# EasyEDA schematic SCH_Addressable through hole LEDs_2022-01-01.json
TITLE: Sheet_1; REV: 1.0; Date: 2021-12-31; Sheet: 1/1; Drawn By: limchengwei; Company: Your Company
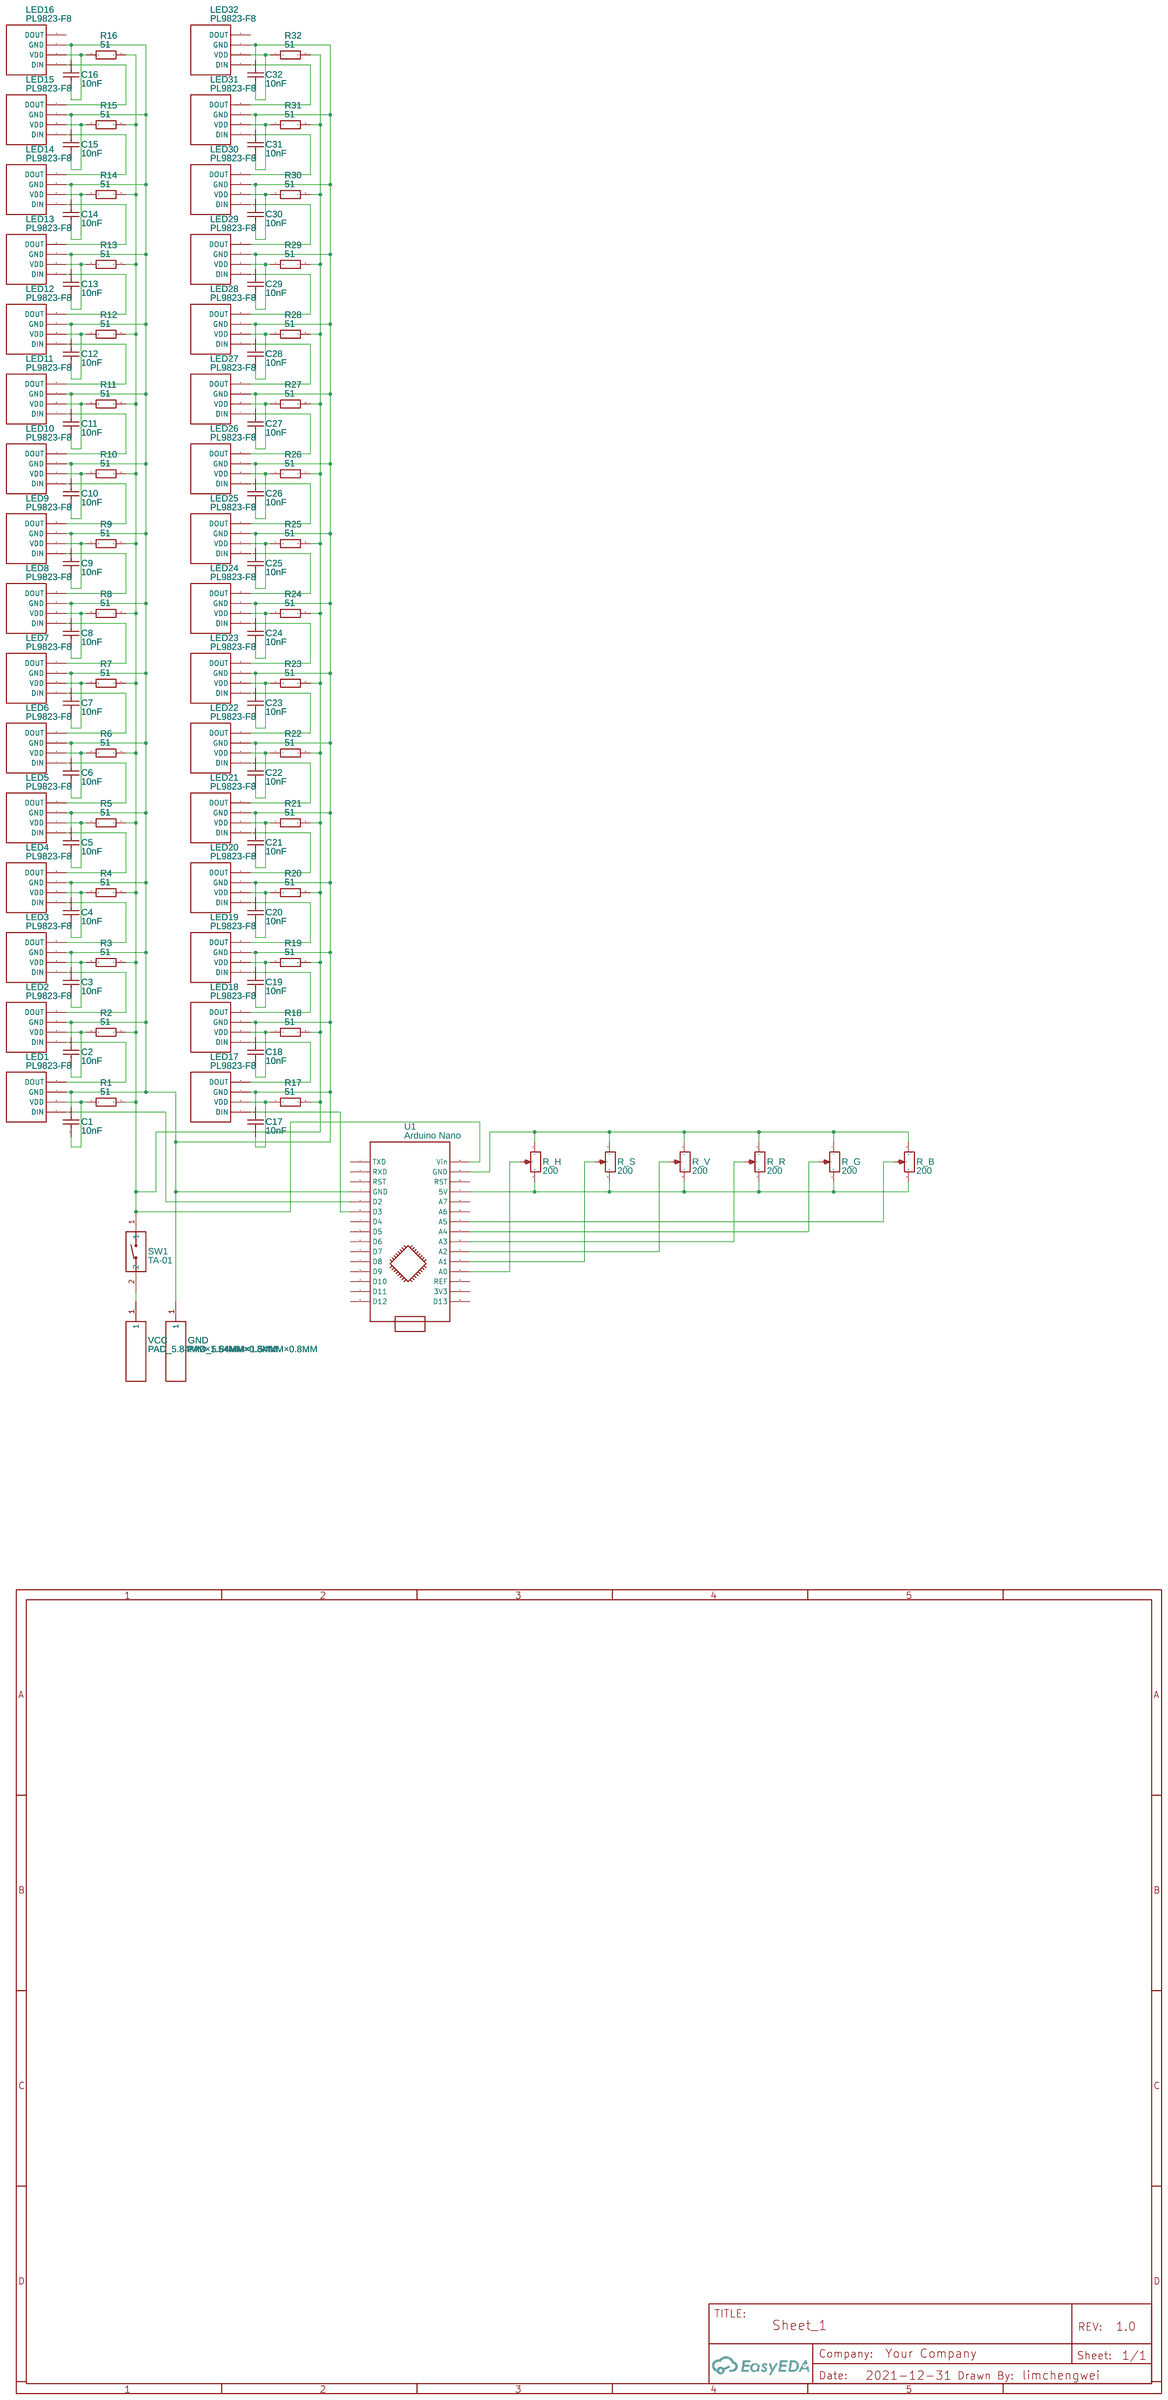
[diagram p0: schematic sheet]

## Parts
C1  10nF  [CAP-TH_L5.0-W2.5-P5.08-D0.7]
C2  10nF  [CAP-TH_L5.0-W2.5-P5.08-D0.7]
C3  10nF  [CAP-TH_L5.0-W2.5-P5.08-D0.7]
C4  10nF  [CAP-TH_L5.0-W2.5-P5.08-D0.7]
C5  10nF  [CAP-TH_L5.0-W2.5-P5.08-D0.7]
C6  10nF  [CAP-TH_L5.0-W2.5-P5.08-D0.7]
C7  10nF  [CAP-TH_L5.0-W2.5-P5.08-D0.7]
C8  10nF  [CAP-TH_L5.0-W2.5-P5.08-D0.7]
C9  10nF  [CAP-TH_L5.0-W2.5-P5.08-D0.7]
C10  10nF  [CAP-TH_L5.0-W2.5-P5.08-D0.7]
C11  10nF  [CAP-TH_L5.0-W2.5-P5.08-D0.7]
C12  10nF  [CAP-TH_L5.0-W2.5-P5.08-D0.7]
C13  10nF  [CAP-TH_L5.0-W2.5-P5.08-D0.7]
C14  10nF  [CAP-TH_L5.0-W2.5-P5.08-D0.7]
C15  10nF  [CAP-TH_L5.0-W2.5-P5.08-D0.7]
C16  10nF  [CAP-TH_L5.0-W2.5-P5.08-D0.7]
C17  10nF  [CAP-TH_L5.0-W2.5-P5.08-D0.7]
C18  10nF  [CAP-TH_L5.0-W2.5-P5.08-D0.7]
C19  10nF  [CAP-TH_L5.0-W2.5-P5.08-D0.7]
C20  10nF  [CAP-TH_L5.0-W2.5-P5.08-D0.7]
C21  10nF  [CAP-TH_L5.0-W2.5-P5.08-D0.7]
C22  10nF  [CAP-TH_L5.0-W2.5-P5.08-D0.7]
C23  10nF  [CAP-TH_L5.0-W2.5-P5.08-D0.7]
C24  10nF  [CAP-TH_L5.0-W2.5-P5.08-D0.7]
C25  10nF  [CAP-TH_L5.0-W2.5-P5.08-D0.7]
C26  10nF  [CAP-TH_L5.0-W2.5-P5.08-D0.7]
C27  10nF  [CAP-TH_L5.0-W2.5-P5.08-D0.7]
C28  10nF  [CAP-TH_L5.0-W2.5-P5.08-D0.7]
C29  10nF  [CAP-TH_L5.0-W2.5-P5.08-D0.7]
C30  10nF  [CAP-TH_L5.0-W2.5-P5.08-D0.7]
C31  10nF  [CAP-TH_L5.0-W2.5-P5.08-D0.7]
C32  10nF  [CAP-TH_L5.0-W2.5-P5.08-D0.7]
GND  PAD_5.84MM×1.54MM×0.8MM  [TESTPOINT-SMD_PAD_5.84MM-1.54MM-0.8MM]
LED1  PL9823-F8  [PL9823-F5]
LED2  PL9823-F8  [PL9823-F5]
LED3  PL9823-F8  [PL9823-F5]
LED4  PL9823-F8  [PL9823-F5]
LED5  PL9823-F8  [PL9823-F5]
LED6  PL9823-F8  [PL9823-F5]
LED7  PL9823-F8  [PL9823-F5]
LED8  PL9823-F8  [PL9823-F5]
LED9  PL9823-F8  [PL9823-F5]
LED10  PL9823-F8  [PL9823-F5]
LED11  PL9823-F8  [PL9823-F5]
LED12  PL9823-F8  [PL9823-F5]
LED13  PL9823-F8  [PL9823-F5]
LED14  PL9823-F8  [PL9823-F5]
LED15  PL9823-F8  [PL9823-F5]
LED16  PL9823-F8  [PL9823-F5]
LED17  PL9823-F8  [PL9823-F5]
LED18  PL9823-F8  [PL9823-F5]
LED19  PL9823-F8  [PL9823-F5]
LED20  PL9823-F8  [PL9823-F5]
LED21  PL9823-F8  [PL9823-F5]
LED22  PL9823-F8  [PL9823-F5]
LED23  PL9823-F8  [PL9823-F5]
LED24  PL9823-F8  [PL9823-F5]
LED25  PL9823-F8  [PL9823-F5]
LED26  PL9823-F8  [PL9823-F5]
LED27  PL9823-F8  [PL9823-F5]
LED28  PL9823-F8  [PL9823-F5]
LED29  PL9823-F8  [PL9823-F5]
LED30  PL9823-F8  [PL9823-F5]
LED31  PL9823-F8  [PL9823-F5]
LED32  PL9823-F8  [PL9823-F5]
R1  51  [RES-TH_BD2.3-L6.5-P10.50-D0.5]
R2  51  [RES-TH_BD2.3-L6.5-P10.50-D0.5]
R3  51  [RES-TH_BD2.3-L6.5-P10.50-D0.5]
R4  51  [RES-TH_BD2.3-L6.5-P10.50-D0.5]
R5  51  [RES-TH_BD2.3-L6.5-P10.50-D0.5]
R6  51  [RES-TH_BD2.3-L6.5-P10.50-D0.5]
R7  51  [RES-TH_BD2.3-L6.5-P10.50-D0.5]
R8  51  [RES-TH_BD2.3-L6.5-P10.50-D0.5]
R9  51  [RES-TH_BD2.3-L6.5-P10.50-D0.5]
R10  51  [RES-TH_BD2.3-L6.5-P10.50-D0.5]
R11  51  [RES-TH_BD2.3-L6.5-P10.50-D0.5]
R12  51  [RES-TH_BD2.3-L6.5-P10.50-D0.5]
R13  51  [RES-TH_BD2.3-L6.5-P10.50-D0.5]
R14  51  [RES-TH_BD2.3-L6.5-P10.50-D0.5]
R15  51  [RES-TH_BD2.3-L6.5-P10.50-D0.5]
R16  51  [RES-TH_BD2.3-L6.5-P10.50-D0.5]
R17  51  [RES-TH_BD2.3-L6.5-P10.50-D0.5]
R18  51  [RES-TH_BD2.3-L6.5-P10.50-D0.5]
R19  51  [RES-TH_BD2.3-L6.5-P10.50-D0.5]
R20  51  [RES-TH_BD2.3-L6.5-P10.50-D0.5]
R21  51  [RES-TH_BD2.3-L6.5-P10.50-D0.5]
R22  51  [RES-TH_BD2.3-L6.5-P10.50-D0.5]
R23  51  [RES-TH_BD2.3-L6.5-P10.50-D0.5]
R24  51  [RES-TH_BD2.3-L6.5-P10.50-D0.5]
R25  51  [RES-TH_BD2.3-L6.5-P10.50-D0.5]
R26  51  [RES-TH_BD2.3-L6.5-P10.50-D0.5]
R27  51  [RES-TH_BD2.3-L6.5-P10.50-D0.5]
R28  51  [RES-TH_BD2.3-L6.5-P10.50-D0.5]
R29  51  [RES-TH_BD2.3-L6.5-P10.50-D0.5]
R30  51  [RES-TH_BD2.3-L6.5-P10.50-D0.5]
R31  51  [RES-TH_BD2.3-L6.5-P10.50-D0.5]
R32  51  [RES-TH_BD2.3-L6.5-P10.50-D0.5]
R_B  200  [RES-ADJ-TH_3362P]
R_G  200  [RES-ADJ-TH_3362P]
R_H  200  [RES-ADJ-TH_3362P]
R_R  200  [RES-ADJ-TH_3362P]
R_S  200  [RES-ADJ-TH_3362P]
R_V  200  [RES-ADJ-TH_3362P]
SW1  TA-01  [SW-TH_2P-L4.1-W9.6-P2.54-LS7.62]
U1  Arduino Nano  [ARDUINO_NANO]
VCC  PAD_5.84MM×1.54MM×0.8MM  [TESTPOINT-SMD_PAD_5.84MM-1.54MM-0.8MM]

## Library data of the parts
C1-C32 = CC1H103ZC1FD3F4D10MF: Supplier: LCSC; Supplier Part: C254084; Manufacturer: Dersonic; Contributor: LCSC; JLCPCB Part Class: Extended Part
GND VCC = PAD_5.84MM×1.54MM×0.8MM: Supplier: LCSC; Supplier Part: C9900000335; Manufacturer Part: PAD_5.84mm×1.54mm×0.8mm; JLCPCB Part Class: Extended Part; Contributor: LCSC
LED1-LED32 = PL9823-F8: Manufacturer Part: PL9823; Contributor: Ian Wallis
R1-R32 = MF1/4W-620Ω±1% T52: Supplier: LCSC; Supplier Part: C119319; Manufacturer: Chian Chia Elec; Contributor: LCSC
R_B R_G R_H R_R R_S R_V = 3362P-1-201LF: Supplier: LCSC; Manufacturer: BOURNS; Supplier Part: C124581; JLCPCB Part Class: Extended Part
SW1 = TA-01: Supplier: LCSC; Supplier Part: C559136; Manufacturer: Yuandi; Contributor: LCSC; JLCPCB Part Class: Extended Part
U1 = Arduino Nano: Contributor: kashesh

## Nets
Net-(C1-1): C1.1 LED1.3(VDD) R1.1
Net-(C1-2): C1.2 C2.2 C3.2 C4.2 C5.2 C6.2 C7.2 C8.2 C9.2 C10.2 C11.2 C12.2 C13.2 C14.2 C15.2 C16.2 C17.2 C18.2 C19.2 C20.2 C21.2 C22.2 C23.2 C24.2 C25.2 C26.2 C27.2 C28.2 C29.2 C30.2 C31.2 C32.2 GND.1 LED1.1(GND) LED2.1(GND) LED3.1(GND) LED4.1(GND) LED5.1(GND) LED6.1(GND) LED7.1(GND) LED8.1(GND) LED9.1(GND) LED10.1(GND) LED11.1(GND) LED12.1(GND) LED13.1(GND) LED14.1(GND) LED15.1(GND) LED16.1(GND) LED17.1(GND) LED18.1(GND) LED19.1(GND) LED20.1(GND) LED21.1(GND) LED22.1(GND) LED23.1(GND) LED24.1(GND) LED25.1(GND) LED26.1(GND) LED27.1(GND) LED28.1(GND) LED29.1(GND) LED30.1(GND) LED31.1(GND) LED32.1(GND) U1.4(GND)
Net-(C2-1): C2.1 LED2.3(VDD) R2.1
Net-(C3-1): C3.1 LED3.3(VDD) R3.1
Net-(C4-1): C4.1 LED4.3(VDD) R4.1
Net-(C5-1): C5.1 LED5.3(VDD) R5.1
Net-(C6-1): C6.1 LED6.3(VDD) R6.1
Net-(C7-1): C7.1 LED7.3(VDD) R7.1
Net-(C8-1): C8.1 LED8.3(VDD) R8.1
Net-(C9-1): C9.1 LED9.3(VDD) R9.1
Net-(C10-1): C10.1 LED10.3(VDD) R10.1
Net-(C11-1): C11.1 LED11.3(VDD) R11.1
Net-(C12-1): C12.1 LED12.3(VDD) R12.1
Net-(C13-1): C13.1 LED13.3(VDD) R13.1
Net-(C14-1): C14.1 LED14.3(VDD) R14.1
Net-(C15-1): C15.1 LED15.3(VDD) R15.1
Net-(C16-1): C16.1 LED16.3(VDD) R16.1
Net-(C17-1): C17.1 LED17.3(VDD) R17.1
Net-(C18-1): C18.1 LED18.3(VDD) R18.1
Net-(C19-1): C19.1 LED19.3(VDD) R19.1
Net-(C20-1): C20.1 LED20.3(VDD) R20.1
Net-(C21-1): C21.1 LED21.3(VDD) R21.1
Net-(C22-1): C22.1 LED22.3(VDD) R22.1
Net-(C23-1): C23.1 LED23.3(VDD) R23.1
Net-(C24-1): C24.1 LED24.3(VDD) R24.1
Net-(C25-1): C25.1 LED25.3(VDD) R25.1
Net-(C26-1): C26.1 LED26.3(VDD) R26.1
Net-(C27-1): C27.1 LED27.3(VDD) R27.1
Net-(C28-1): C28.1 LED28.3(VDD) R28.1
Net-(C29-1): C29.1 LED29.3(VDD) R29.1
Net-(C30-1): C30.1 LED30.3(VDD) R30.1
Net-(C31-1): C31.1 LED31.3(VDD) R31.1
Net-(C32-1): C32.1 LED32.3(VDD) R32.1
Net-(LED1-2): LED1.2(DOUT) LED2.4(DIN)
Net-(LED1-4): LED1.4(DIN) U1.5(D2)
Net-(LED2-2): LED2.2(DOUT) LED3.4(DIN)
Net-(LED3-2): LED3.2(DOUT) LED4.4(DIN)
Net-(LED4-2): LED4.2(DOUT) LED5.4(DIN)
Net-(LED5-2): LED5.2(DOUT) LED6.4(DIN)
Net-(LED6-2): LED6.2(DOUT) LED7.4(DIN)
Net-(LED7-2): LED7.2(DOUT) LED8.4(DIN)
Net-(LED8-2): LED8.2(DOUT) LED9.4(DIN)
Net-(LED9-2): LED9.2(DOUT) LED10.4(DIN)
Net-(LED10-2): LED10.2(DOUT) LED11.4(DIN)
Net-(LED11-2): LED11.2(DOUT) LED12.4(DIN)
Net-(LED12-2): LED12.2(DOUT) LED13.4(DIN)
Net-(LED13-2): LED13.2(DOUT) LED14.4(DIN)
Net-(LED14-2): LED14.2(DOUT) LED15.4(DIN)
Net-(LED15-2): LED15.2(DOUT) LED16.4(DIN)
Net-(LED17-2): LED17.2(DOUT) LED18.4(DIN)
Net-(LED17-4): LED17.4(DIN) U1.6(D3)
Net-(LED18-2): LED18.2(DOUT) LED19.4(DIN)
Net-(LED19-2): LED19.2(DOUT) LED20.4(DIN)
Net-(LED20-2): LED20.2(DOUT) LED21.4(DIN)
Net-(LED21-2): LED21.2(DOUT) LED22.4(DIN)
Net-(LED22-2): LED22.2(DOUT) LED23.4(DIN)
Net-(LED23-2): LED23.2(DOUT) LED24.4(DIN)
Net-(LED24-2): LED24.2(DOUT) LED25.4(DIN)
Net-(LED25-2): LED25.2(DOUT) LED26.4(DIN)
Net-(LED26-2): LED26.2(DOUT) LED27.4(DIN)
Net-(LED27-2): LED27.2(DOUT) LED28.4(DIN)
Net-(LED28-2): LED28.2(DOUT) LED29.4(DIN)
Net-(LED29-2): LED29.2(DOUT) LED30.4(DIN)
Net-(LED30-2): LED30.2(DOUT) LED31.4(DIN)
Net-(LED31-2): LED31.2(DOUT) LED32.4(DIN)
Net-(R1-2): R1.2 R2.2 R3.2 R4.2 R5.2 R6.2 R7.2 R8.2 R9.2 R10.2 R11.2 R12.2 R13.2 R14.2 R15.2 R16.2 R17.2 R18.2 R19.2 R20.2 R21.2 R22.2 R23.2 R24.2 R25.2 R26.2 R27.2 R28.2 R29.2 R30.2 R31.2 R32.2 SW1.1 U1.30(Vin)
Net-(R_B-1): R_B.1 R_G.1 R_H.1 R_R.1 R_S.1 R_V.1 U1.29(GND)
Net-(R_B-2): R_B.2 U1.24(A5)
Net-(R_B-3): R_B.3 R_G.3 R_H.3 R_R.3 R_S.3 R_V.3 U1.27(5V)
Net-(R_G-2): R_G.2 U1.23(A4)
Net-(R_H-2): R_H.2 U1.19(A0)
Net-(R_R-2): R_R.2 U1.22(A3)
Net-(R_S-2): R_S.2 U1.20(A1)
Net-(R_V-2): R_V.2 U1.21(A2)
Net-(SW1-2): SW1.2 VCC.1

Not connected (* = marked no-connect by the designer): LED16 2(DOUT); LED32 2(DOUT); U1 1(TXD) 2(RXD) 3(RST) 7(D4) 8(D5) 9(D6) 10(D7) 11(D8) 12(D9) 13(D10) 14(D11) 15(D12) 16(D13) 17(3V3) 18(REF) 25(A6) 26(A7) 28(RST)
